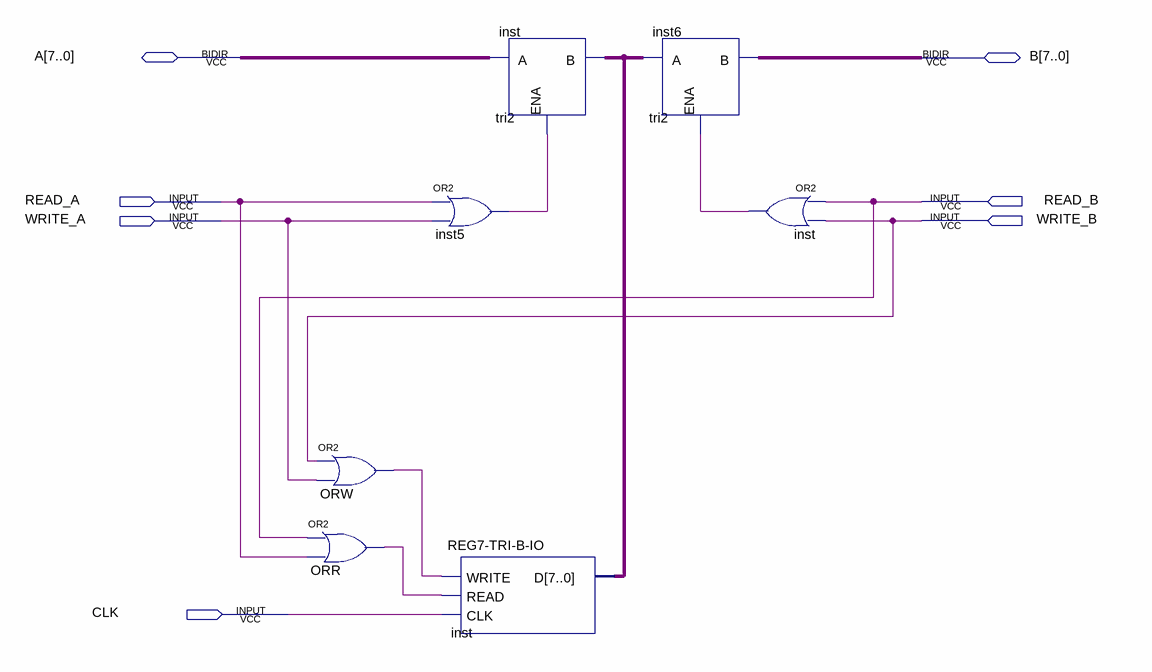
[diagram p0: schematic sheet]
// Quartus schematic REG8-TRI-B-IO2.bdf as structural Verilog: 7 symbols, 7 pins
module \REG8-TRI-B-IO2  (
  input  READ_A,
  input  READ_B,
  input  WRITE_A,
  input  WRITE_B,
  input  CLK,
  inout  [7:0] A,
  inout  [7:0] B
);

  wire inst5_out, inst_out, ORR_out, ORW_out;
  wire [7:0] inst_d;

  or ORR (ORR_out, READ_B, READ_A);
  or ORW (ORW_out, WRITE_B, WRITE_A);
  or inst5 (inst5_out, READ_A, WRITE_A);
  \REG7-TRI-B-IO  inst (.WRITE(ORW_out), .READ(ORR_out), .CLK(CLK), .D(inst_d));
  tri2 inst_dup2 (.ENA(inst5_out), .B(inst_d), .A(A));
  tri2 inst6 (.ENA(inst_out), .B(B), .A(inst_d));
  or inst_dup3 (inst_out, READ_B, WRITE_B);
endmodule
